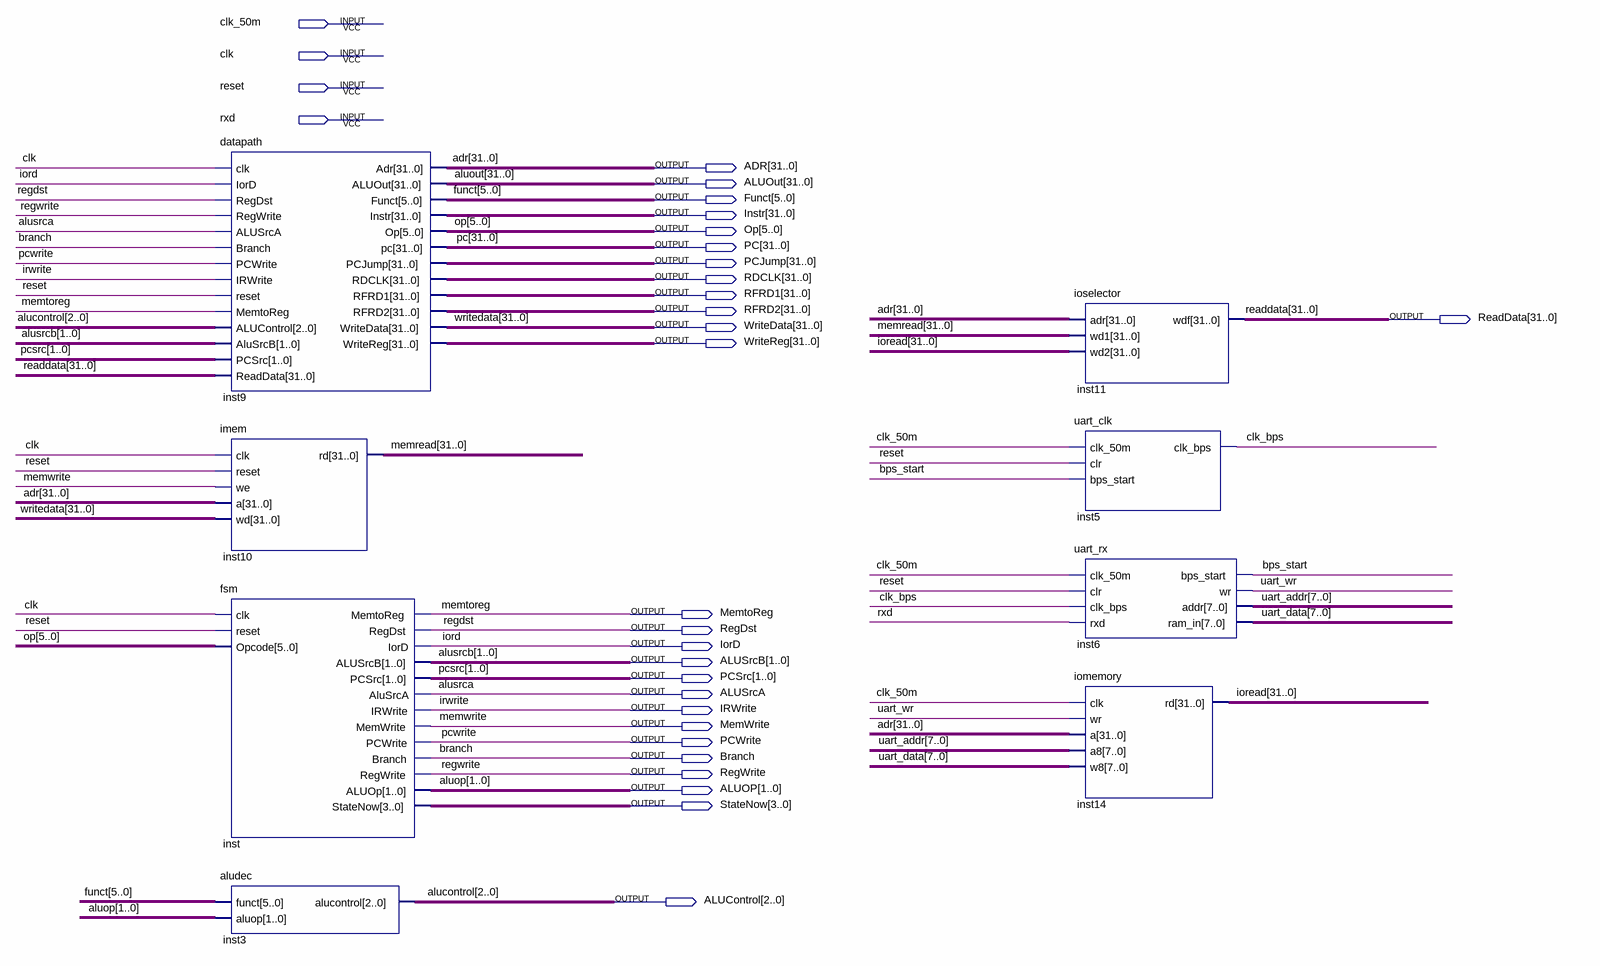
[diagram p0: schematic sheet]
// Quartus schematic mips_computer.bdf as structural Verilog: 8 symbols, 31 pins
module mips_computer (
  input  clk_50m,
  input  clk,
  input  reset,
  input  rxd,
  output [31:0] ADR,
  output [31:0] ALUOut,
  output [5:0] Funct,
  output [31:0] Instr,
  output [5:0] Op,
  output [31:0] PC,
  output [31:0] PCJump,
  output [31:0] RDCLK,
  output [31:0] RFRD1,
  output [31:0] RFRD2,
  output [31:0] ReadData,
  output [31:0] WriteData,
  output [31:0] WriteReg,
  output MemtoReg,
  output RegDst,
  output IorD,
  output [1:0] ALUSrcB,
  output [1:0] PCSrc,
  output ALUSrcA,
  output IRWrite,
  output MemWrite,
  output PCWrite,
  output Branch,
  output RegWrite,
  output [1:0] ALUOP,
  output [3:0] StateNow,
  output [2:0] ALUControl
);

  wire bps_start, clk_bps, uart_wr;
  wire [7:0] uart_addr, uart_data;
  wire [31:0] ioread, memread;

  datapath inst9 (
    .clk(clk), .IorD(IorD), .RegDst(RegDst), .RegWrite(RegWrite), .ALUSrcA(ALUSrcA), .Branch(Branch),
    .PCWrite(PCWrite), .IRWrite(IRWrite), .reset(reset), .MemtoReg(MemtoReg), .ALUControl(ALUControl),
    .AluSrcB(ALUSrcB), .PCSrc(PCSrc), .ReadData(ReadData), .Adr(ADR), .ALUOut(ALUOut), .Funct(Funct),
    .Instr(Instr), .Op(Op), .pc(PC), .PCJump(PCJump), .RDCLK(RDCLK), .RFRD1(RFRD1), .RFRD2(RFRD2),
    .WriteData(WriteData), .WriteReg(WriteReg));
  imem inst10 (.clk(clk), .reset(reset), .we(MemWrite), .a(ADR), .wd(WriteData), .rd(memread));
  fsm inst (
    .clk(clk), .reset(reset), .Opcode(Op), .MemtoReg(MemtoReg), .RegDst(RegDst), .IorD(IorD),
    .ALUSrcB(ALUSrcB), .PCSrc(PCSrc), .AluSrcA(ALUSrcA), .IRWrite(IRWrite), .MemWrite(MemWrite),
    .PCWrite(PCWrite), .Branch(Branch), .RegWrite(RegWrite), .ALUOp(ALUOP), .StateNow(StateNow));
  aludec inst3 (.funct(Funct), .aluop(ALUOP), .alucontrol(ALUControl));
  ioselector inst11 (.adr(ADR), .wd1(memread), .wd2(ioread), .wdf(ReadData));
  uart_clk inst5 (.clk_50m(clk_50m), .clr(reset), .bps_start(bps_start), .clk_bps(clk_bps));
  uart_rx inst6 (
    .clk_50m(clk_50m), .clr(reset), .clk_bps(clk_bps), .rxd(rxd), .bps_start(bps_start), .wr(uart_wr),
    .addr(uart_addr), .ram_in(uart_data));
  iomemory inst14 (.clk(clk_50m), .wr(uart_wr), .a(ADR), .a8(uart_addr), .w8(uart_data), .rd(ioread));
endmodule
